# EAGLE schematic v1 (EAGLE 9.6.2)
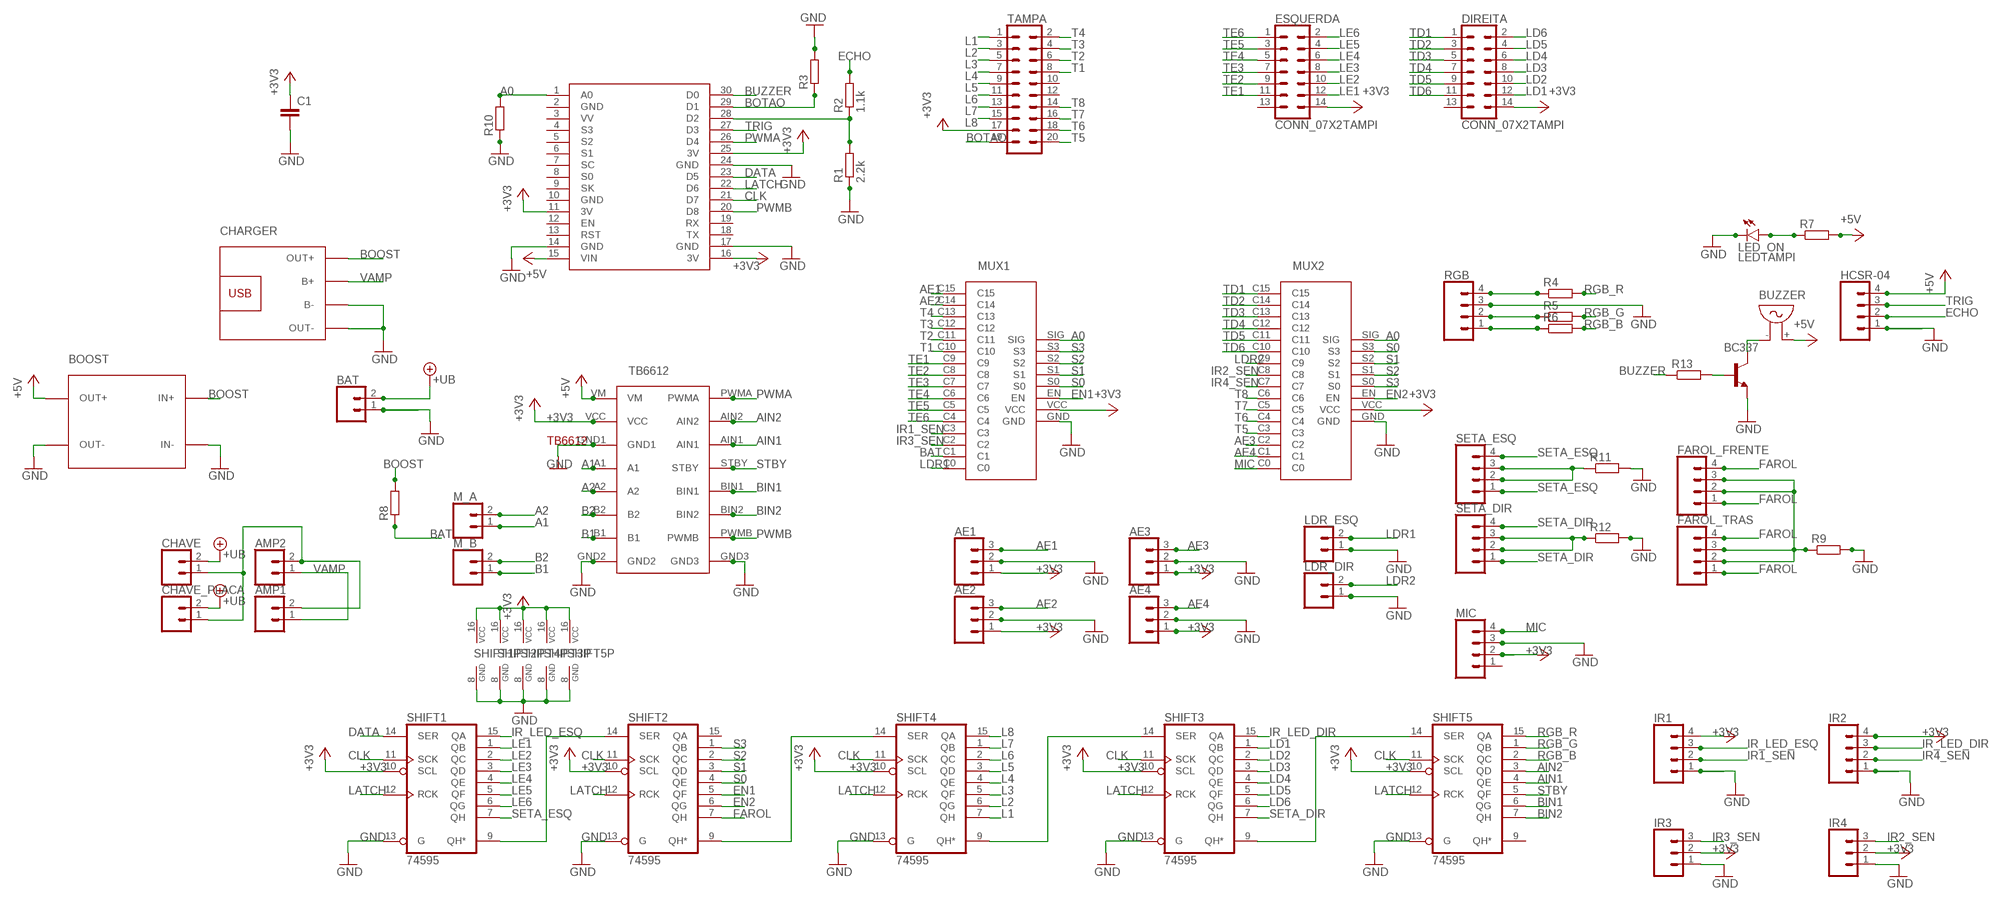
[diagram p0: schematic, sheet 1]

## Parts
AE1  CONN_03TAMPI  [TAMPI_1X03]
AE2  CONN_03TAMPI  [TAMPI_1X03]
AE3  CONN_03TAMPI  [TAMPI_1X03]
AE4  CONN_03TAMPI  [TAMPI_1X03]
AMP1  CONN_02TAMPI  [TAMPI_1X02]
AMP2  CONN_02TAMPI  [TAMPI_1X02]
BAT  CONN_02TAMPI  [TAMPI_1X02]
BC337  BC337  [TAMPI_BC337]
BOOST  MT3608TAMPI  [TAMPI_MT3608]
BUZZER  BUZZERTAMPI  [TAMPI_BUZZER]
C1  CAPACITORTAMPI  [TAMPI_C2.5-3]
CHARGER  TP4056TAMPI  [TAMPI_TP4056]
CHAVE  CONN_02TAMPI  [TAMPI_1X02]
CHAVE_PLACA  CONN_02TAMPI  [TAMPI_1X02]
DIREITA  CONN_07X2TAMPI  [TAMPI_2X7]
ESQUERDA  CONN_07X2TAMPI  [TAMPI_2X7]
FAROL_FRENTE  CONN_04  [TAMPI_1X04]
FAROL_TRAS  CONN_04  [TAMPI_1X04]
HCSR-04  CONN_04  [TAMPI_1X04]
IR1  CONN_04  [TAMPI_1X04]
IR2  CONN_04  [TAMPI_1X04]
IR3  CONN_03TAMPI  [TAMPI_1X03]
IR4  CONN_03TAMPI  [TAMPI_1X03]
LDR_DIR  CONN_02TAMPI  [TAMPI_1X02]
LDR_ESQ  CONN_02TAMPI  [TAMPI_1X02]
LED_ON  LEDTAMPI  [TAMPI_LED3MM]
M_A  CONN_02TAMPI  [TAMPI_1X02]
M_B  CONN_02TAMPI  [TAMPI_1X02]
MIC  CONN_04  [TAMPI_1X04]
MUX1  4067TAMPI  [TAMPI_4067]
MUX2  4067TAMPI  [TAMPI_4067]
R1  2.2k  RESISTOR  [TAMPI_RES]
R2  1.1k  RESISTOR  [TAMPI_RES]
R3  RESISTOR  [TAMPI_RES]
R4  RESISTOR  [TAMPI_RES]
R5  RESISTOR  [TAMPI_RES]
R6  RESISTOR  [TAMPI_RES]
R7  RESISTOR  [TAMPI_RES]
R8  RESISTOR  [TAMPI_RES]
R9  RESISTOR  [TAMPI_RES]
R10  RESISTOR  [TAMPI_RES]
R11  RESISTOR  [TAMPI_RES]
R12  RESISTOR  [TAMPI_RES]
R13  RESISTOR  [TAMPI_RES]
RGB  CONN_04  [TAMPI_1X04]
SETA_DIR  CONN_04  [TAMPI_1X04]
SETA_ESQ  CONN_04  [TAMPI_1X04]
SHIFT1  74595  [TAMPI_74595]
SHIFT2  74595  [TAMPI_74595]
SHIFT3  74595  [TAMPI_74595]
SHIFT4  74595  [TAMPI_74595]
SHIFT5  74595  [TAMPI_74595]
TAMPA  CONN_10X2TAMPI  [TAMPI_2X10]
TB6612  TB6612FNGTAMPI  [TAMPI_TB6612]
U$1  NODEMCUTAMPI  [TAMPI_NODEMCU]

## Nets
+3V3: AE1.1 AE2.1 AE3.1 AE4.1 C1.1 DIREITA.14 ESQUERDA.14 IR1.4 IR2.4 IR3.2 IR4.2 MIC.2 MUX1.VCC MUX2.VCC SHIFT1.10(SCL) SHIFT1.16(VCC) SHIFT2.10(SCL) SHIFT2.16(VCC) SHIFT3.10(SCL) SHIFT3.16(VCC) SHIFT4.10(SCL) SHIFT4.16(VCC) SHIFT5.10(SCL) SHIFT5.16(VCC) TAMPA.17 TB6612.VCC U$1.11(3V) U$1.16(3V) U$1.25(3V)
+5V: BOOST.OUT+ BUZZER.+ HCSR-04.4 R7.2 TB6612.VM U$1.15(VIN)
+UB [bat power]: BAT.2 CHAVE.2 CHAVE_PLACA.2
A0: MUX1.SIG MUX2.SIG R10.2 U$1.1(A0)
A1: M_A.1 TB6612.A1
A2: M_A.2 TB6612.A2
AE1: AE1.3 MUX1.C15
AE2: AE2.3 MUX1.C14
AE3: AE3.3 MUX2.C2
AE4: AE4.3 MUX2.C1
AIN1: SHIFT5.4(QE) TB6612.AIN1
AIN2: SHIFT5.3(QD) TB6612.AIN2
B1: M_B.1 TB6612.B1
B2: M_B.2 TB6612.B2
BAT: MUX1.C1 R8.1
BIN1: SHIFT5.6(QG) TB6612.BIN1
BIN2: SHIFT5.7(QH) TB6612.BIN2
BOOST [bat power]: BOOST.IN+ CHARGER.OUT+ R8.2
BOTAO: R3.1 TAMPA.19 U$1.29(D1)
BUZZER: R13.1 U$1.30(D0)
CLK: SHIFT1.11(SCK) SHIFT2.11(SCK) SHIFT3.11(SCK) SHIFT4.11(SCK) SHIFT5.11(SCK) U$1.21(D7)
DATA: SHIFT1.14(SER) U$1.23(D5)
ECHO: HCSR-04.2 R2.2
EN1: MUX1.EN SHIFT2.5(QF)
EN2: MUX2.EN SHIFT2.6(QG)
FAROL: FAROL_FRENTE.1 FAROL_FRENTE.4 FAROL_TRAS.1 FAROL_TRAS.4 SHIFT2.7(QH)
GND: AE1.2 AE2.2 AE3.2 AE4.2 BAT.1 BC337.1(E) BOOST.IN- BOOST.OUT- C1.2 CHARGER.B- CHARGER.OUT- HCSR-04.1 IR1.1 IR2.1 IR3.1 IR4.1 LDR_DIR.1 LDR_ESQ.1 LED_ON.K(C) MIC.3 MUX1.GND MUX2.GND R1.1 R3.2 R9.2 R10.1 R11.2 R12.2 RGB.3 SHIFT1.8(GND) SHIFT1.13(G) SHIFT2.8(GND) SHIFT2.13(G) SHIFT3.8(GND) SHIFT3.13(G) SHIFT4.8(GND) SHIFT4.13(G) SHIFT5.8(GND) SHIFT5.13(G) TB6612.GND1 TB6612.GND2 TB6612.GND3 U$1.14(GND) U$1.17(GND) U$1.24(GND)
IR1_SEN: IR1.2 MUX1.C3
IR2_SEN: IR4.3 MUX2.C8
IR3_SEN: IR3.3 MUX1.C2
IR4_SEN: IR2.2 MUX2.C7
IR_LED_DIR: IR2.3 SHIFT3.15(QA)
IR_LED_ESQ: IR1.3 SHIFT1.15(QA)
L1: SHIFT4.7(QH) TAMPA.1
L2: SHIFT4.6(QG) TAMPA.3
L3: SHIFT4.5(QF) TAMPA.5
L4: SHIFT4.4(QE) TAMPA.7
L5: SHIFT4.3(QD) TAMPA.9
L6: SHIFT4.2(QC) TAMPA.11
L7: SHIFT4.1(QB) TAMPA.13
L8: SHIFT4.15(QA) TAMPA.15
LATCH: SHIFT1.12(RCK) SHIFT2.12(RCK) SHIFT3.12(RCK) SHIFT4.12(RCK) SHIFT5.12(RCK) U$1.22(D6)
LD1: DIREITA.12 SHIFT3.1(QB)
LD2: DIREITA.10 SHIFT3.2(QC)
LD3: DIREITA.8 SHIFT3.3(QD)
LD4: DIREITA.6 SHIFT3.4(QE)
LD5: DIREITA.4 SHIFT3.5(QF)
LD6: DIREITA.2 SHIFT3.6(QG)
LDR1: LDR_ESQ.2 MUX1.C0
LDR2: LDR_DIR.2 MUX2.C9
LE1: ESQUERDA.12 SHIFT1.1(QB)
LE2: ESQUERDA.10 SHIFT1.2(QC)
LE3: ESQUERDA.8 SHIFT1.3(QD)
LE4: ESQUERDA.6 SHIFT1.4(QE)
LE5: ESQUERDA.4 SHIFT1.5(QF)
LE6: ESQUERDA.2 SHIFT1.6(QG)
MIC: MIC.4 MUX2.C0
N$1: R4.1 RGB.4
N$2: R5.1 RGB.2
N$3: R6.1 RGB.1
N$4: R11.1 SETA_ESQ.2 SETA_ESQ.3
N$5: SHIFT1.9(QH*) SHIFT2.14(SER)
N$6: FAROL_FRENTE.2 FAROL_FRENTE.3 FAROL_TRAS.2 FAROL_TRAS.3 R9.1
N$7: R12.1 SETA_DIR.2 SETA_DIR.3
N$8 [bat power]: AMP1.2 AMP2.2 CHAVE.1 CHAVE_PLACA.1
N$9: BC337.2(B) R13.2
N$10: BC337.3(C) BUZZER.-
N$28: LED_ON.A R7.1
N$29: SHIFT3.9(QH*) SHIFT5.14(SER)
N$30: SHIFT3.14(SER) SHIFT4.9(QH*)
N$31: SHIFT2.9(QH*) SHIFT4.14(SER)
N$39: R1.2 R2.1 U$1.28(D2)
PWMA: TB6612.PWMA U$1.26(D4)
PWMB: TB6612.PWMB U$1.20(D8)
RGB_B: R6.2 SHIFT5.2(QC)
RGB_G: R5.2 SHIFT5.1(QB)
RGB_R: R4.2 SHIFT5.15(QA)
S0: MUX1.S0 MUX2.S3 SHIFT2.4(QE)
S1: MUX1.S1 MUX2.S2 SHIFT2.3(QD)
S2: MUX1.S2 MUX2.S1 SHIFT2.2(QC)
S3: MUX1.S3 MUX2.S0 SHIFT2.1(QB)
SETA_DIR: SETA_DIR.1 SETA_DIR.4 SHIFT3.7(QH)
SETA_ESQ: SETA_ESQ.1 SETA_ESQ.4 SHIFT1.7(QH)
STBY: SHIFT5.5(QF) TB6612.STBY
T1: MUX1.C10 TAMPA.8
T2: MUX1.C11 TAMPA.6
T3: MUX1.C12 TAMPA.4
T4: MUX1.C13 TAMPA.2
T5: MUX2.C3 TAMPA.20
T6: MUX2.C4 TAMPA.18
T7: MUX2.C5 TAMPA.16
T8: MUX2.C6 TAMPA.14
TD1: DIREITA.1 MUX2.C15
TD2: DIREITA.3 MUX2.C14
TD3: DIREITA.5 MUX2.C13
TD4: DIREITA.7 MUX2.C12
TD5: DIREITA.9 MUX2.C11
TD6: DIREITA.11 MUX2.C10
TE1: ESQUERDA.11 MUX1.C9
TE2: ESQUERDA.9 MUX1.C8
TE3: ESQUERDA.7 MUX1.C7
TE4: ESQUERDA.5 MUX1.C6
TE5: ESQUERDA.3 MUX1.C5
TE6: ESQUERDA.1 MUX1.C4
TRIG: HCSR-04.3 U$1.27(D3)
VAMP [bat power]: AMP1.1 AMP2.1 CHARGER.B+
Unconnected: DIREITA.13 ESQUERDA.13 MIC.1 SHIFT2.15(QA) SHIFT5.9(QH*) TAMPA.10 TAMPA.12 U$1.3(VV) U$1.4(S3) U$1.5(S2) U$1.6(S1) U$1.7(SC) U$1.8(S0) U$1.9(SK) U$1.12(EN) U$1.13(RST) U$1.18(TX) U$1.19(RX)

## Power pins joined to a net without a drawn wire
GND: U$1.2(GND) U$1.10(GND)

## Library data of the parts
AE1-AE4 IR3 IR4 = tampi:CONN_03: Multi connection point. Often used as Generic Header-pin footprint for 0.1 inch spaced/style header connections On any of the 0.1 inch spaced packages, you can populate with these: Break Away Headers - Straight <https://www.sparkfun.com/products/116> (PRT-00116) Break Away Male Headers - Right Angle <https://www.sparkfun.com/products/553> (PRT-00553) Female Headers <https://www.sparkfun.com/products/115> (PRT-00115) Break Away Headers - Machine Pin <https://www.sparkfun.com/products/117> (PRT-00117) Break Away Female Headers - Swiss Machine Pin <https://www.sparkfun.com/products/743> (PRT-00743) Stackable Header - 3 Pin (Female, 0.1") <https://www.sparkfun.com/products/13875> (PRT-13875) For SCREWTERMINALS and SPRING TERMINALS visit here: Screw Terimnals on SparkFun.com <https://www.sparkfun.com/search/results?term=Screw+Terminals> (5mm/3.5mm/2.54mm spacing) This device is also useful as a general connection point to wire up your design to another part of your project. Our various solder wires solder well into these plated through hole pads. Hook-Up Wire - Assortment (Stranded, 22 AWG) <https://www.sparkfun.com/products/11375> (PRT-11375) Hook-Up Wire - Assortment (Solid Core, 22 AWG) <https://www.sparkfun.com/products/11367> (PRT-11367) View the entire wire category on our website here <https://www.sparkfun.com/categories/141> Special notes: Molex polarized connector foot print use with SKU : PRT-08232 with associated crimp pins and housings.
AMP1 AMP2 BAT CHAVE CHAVE_PLACA LDR_DIR LDR_ESQ M_A M_B = tampi:CONN_02: Multi connection point. Often used as Generic Header-pin footprint for 0.1 inch spaced/style header connections On any of the 0.1 inch spaced packages, you can populate with these: Break Away Headers - Straight <https://www.sparkfun.com/products/116> (PRT-00116) Break Away Male Headers - Right Angle <https://www.sparkfun.com/products/553> (PRT-00553) Female Headers <https://www.sparkfun.com/products/115> (PRT-00115) Break Away Headers - Machine Pin <https://www.sparkfun.com/products/117> (PRT-00117) Break Away Female Headers - Swiss Machine Pin <https://www.sparkfun.com/products/743> (PRT-00743) For SCREWTERMINALS and SPRING TERMINALS visit here: Screw Terimnals on SparkFun.com <https://www.sparkfun.com/search/results?term=Screw+Terminals> (5mm/3.5mm/2.54mm spacing) This device is also useful as a general connection point to wire up your design to another part of your project. Our various solder wires solder well into these plated through hole pads. Hook-Up Wire - Assortment (Stranded, 22 AWG) <https://www.sparkfun.com/products/11375> (PRT-11375) Hook-Up Wire - Assortment (Solid Core, 22 AWG) <https://www.sparkfun.com/products/11367> (PRT-11367) View the entire wire category on our website here <https://www.sparkfun.com/categories/141> Special notes: Molex polarized connector foot print use with: PRT-08233 with associated crimp pins and housings. 2.54_SCREWTERM for use with PRT-10571. 3.5mm Screw Terminal footprints for PRT-08084 5mm Screw Terminal footprints for use with PRT-08432
BC337 = tampi:BC337: NPN Transistor
BOOST = tampi:MT3608: DC/DC Step-Up Regulator based on MT3608 chip MT3608 datasheet available here: https://www.olimex.com/Products/Breadboarding/BB-PWR-3608/resources/MT3608.pdf Click here to find device on ebay.com <http://www.ebay.com/sch/mt3608+module>
BUZZER = tampi:BUZZER: BUZZER Source: Buerklin; OC_FARNELL: unknown; OC_NEWARK: unknown
C1 = tampi:CAPACITOR: CAPACITOR naming: grid - package width
CHARGER = tampi:TP4056: Lithium Battery 5V Charger with protection circuit More details available here: http://www.instructables.com/id/DIY-Lithium-ion-Battery-Charger/step4/TP4056-based-lithium-ion-battery-charger-module/ Click here to find device on ebay.com <http://www.ebay.com/sch/tp4056+charger+usb+protection>
DIREITA ESQUERDA = tampi:CONN_07X2
FAROL_FRENTE FAROL_TRAS HCSR-04 IR1 IR2 MIC RGB SETA_DIR SETA_ESQ = tampi:CONN_04: Multi connection point. Often used as Generic Header-pin footprint for 0.1 inch spaced/style header connections On any of the 0.1 inch spaced packages, you can populate with these: Break Away Headers - Straight <https://www.sparkfun.com/products/116> (PRT-00116) Break Away Male Headers - Right Angle <https://www.sparkfun.com/products/553> (PRT-00553) Female Headers <https://www.sparkfun.com/products/115> (PRT-00115) Break Away Headers - Machine Pin <https://www.sparkfun.com/products/117> (PRT-00117) Break Away Female Headers - Swiss Machine Pin <https://www.sparkfun.com/products/743> (PRT-00743) For SCREWTERMINALS and SPRING TERMINALS visit here: Screw Terimnals on SparkFun.com <https://www.sparkfun.com/search/results?term=Screw+Terminals> (5mm/3.5mm/2.54mm spacing) This device is also useful as a general connection point to wire up your design to another part of your project. Our various solder wires solder well into these plated through hole pads. Hook-Up Wire - Assortment (Stranded, 22 AWG) <https://www.sparkfun.com/products/11375> (PRT-11375) Hook-Up Wire - Assortment (Solid Core, 22 AWG) <https://www.sparkfun.com/products/11367> (PRT-11367) View the entire wire category on our website here <https://www.sparkfun.com/categories/141> Special notes: Molex polarized connector foot print use with SKU : PRT-08231 with associated crimp pins and housings. 1MM SMD Version SKU: PRT-10208
LED_ON = tampi:LED: Low Current (2mA) LED 3 mm Tinted Diffused Package color RED Source: Data sheet <http://www.farnell.com/datasheets/391100.pdf>
MUX1 MUX2 = tampi:4067
R1-R13 = tampi:RESISTOR: RESISTOR, European symbol
SHIFT1-SHIFT5 = tampi:74595: 8-bit SHIFT REGISTER, output latch
TAMPA = tampi:CONN_10X2: Multi connection point. Often used as Generic Header-pin footprint for 0.1 inch spaced/style header connections On any of the 0.1 inch spaced packages, you can populate with these: Break Away Headers - Straight <https://www.sparkfun.com/products/116> (PRT-00116) Break Away Male Headers - Right Angle <https://www.sparkfun.com/products/553> (PRT-00553) Female Headers <https://www.sparkfun.com/products/115> (PRT-00115) Break Away Headers - Machine Pin <https://www.sparkfun.com/products/117> (PRT-00117) Break Away Female Headers - Swiss Machine Pin <https://www.sparkfun.com/products/743> (PRT-00743) Special note about the "SPECIAL" package: This was SPECIALLY designed to be used with our Graphic LCD Backpack. Be sure you want to use this! It is not only staggered on each line of header holes, but IT IS ALSO offset of the center point of the top and bottom lines by 5 mil. This causes the headers to lock into place on the "standard" footprint on the LCD screen. The extra squares on the tdocu layer are there simply to reference other pins (if you were to actually populate a longer header than ten long - this is what we do with the backpacks).
TB6612 = tampi:TB6612FNG
U$1 = tampi:NODEMCU

## Net classes
1 bat power: width 0.8 mm, drill 0.8 mm
2 esp power: width 0.3 mm, drill 0.3 mm